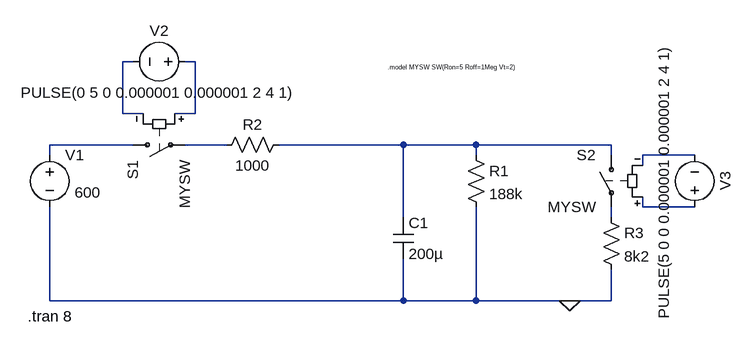
[diagram p0: schematic Discharge.asc]
Discharge.asc, the LTspice schematic file:
Version 4
SHEET 1 880 680
WIRE -128 16 -144 16
WIRE -32 16 -48 16
WIRE -144 96 -144 16
WIRE -112 96 -144 96
WIRE -32 96 -32 16
WIRE -32 96 -64 96
WIRE -128 144 -256 144
WIRE 16 144 -48 144
WIRE 288 144 96 144
WIRE 400 144 288 144
WIRE 608 144 400 144
WIRE -256 160 -256 144
WIRE 400 160 400 144
WIRE 608 160 608 144
WIRE 736 160 656 160
WIRE 656 176 656 160
WIRE 656 240 656 224
WIRE 736 240 656 240
WIRE 288 256 288 144
WIRE 608 256 608 240
WIRE -256 384 -256 240
WIRE 288 384 288 320
WIRE 288 384 -256 384
WIRE 400 384 400 240
WIRE 400 384 288 384
WIRE 544 384 400 384
WIRE 608 384 608 336
WIRE 608 384 544 384
FLAG 544 384 0
SYMBOL cap 272 256 R0
SYMATTR InstName C1
SYMATTR Value 200µ
SYMBOL res 384 144 R0
SYMATTR InstName R1
SYMATTR Value 188k
SYMBOL voltage -256 144 R0
WINDOW 3 38 73 Left 2
WINDOW 123 0 0 Left 0
WINDOW 39 0 0 Left 0
SYMATTR Value 600
SYMATTR InstName V1
SYMBOL res 112 128 R90
WINDOW 0 0 56 VBottom 2
WINDOW 3 32 56 VTop 2
SYMATTR InstName R2
SYMATTR Value 1000
SYMBOL res 592 240 R0
SYMATTR InstName R3
SYMATTR Value 8k2
SYMBOL sw -144 144 M90
SYMATTR InstName S1
SYMATTR Value MYSW
SYMBOL voltage -32 16 R90
WINDOW 0 -32 56 VBottom 2
WINDOW 3 32 56 VTop 2
WINDOW 123 0 0 Left 0
WINDOW 39 0 0 Left 0
SYMATTR InstName V2
SYMATTR Value PULSE(0 5 0 0.000001 0.000001 2 4 1)
SYMBOL sw 608 144 M0
SYMATTR InstName S2
SYMATTR Value MYSW
SYMBOL voltage 736 256 R180
WINDOW 0 -32 56 VBottom 2
WINDOW 3 32 56 VTop 2
WINDOW 123 0 0 Left 0
WINDOW 39 0 0 Left 0
SYMATTR InstName V3
SYMATTR Value PULSE(5 0 0 0.000001 0.000001 2 4 1)
TEXT 264 24 Left 0 !.model MYSW SW(Ron=5 Roff=1Meg Vt=2)
TEXT -290 408 Left 2 !.tran 8

The netlist it stands for:
* Discharge.asc
C1 N005 0 200µ
R1 N005 0 188k
V1 N003 0 600
R2 N005 N004 1000
R3 N008 0 8k2
S1 N003 N004 N002 N001 MYSW
V2 N002 N001 PULSE(0 5 0 0.000001 0.000001 2 4 1)
S2 N005 N008 N007 N006 MYSW
V3 N007 N006 PULSE(5 0 0 0.000001 0.000001 2 4 1)
.model MYSW SW(Ron=5 Roff=1Meg Vt=2)
.tran 8
.backanno
.end